# Altium project Goldstrike1_Rev01.PrjPCB (part 4 of 4)

## Sheet GS_01_Core.SchDoc: Title
size A3; Date: Date; CompanyName: Integrated Micro-Electronics Bulgaria; Organization: Design & Development Department; Address1: Drawing Type; Address2: Address 1; Address3: Address 2; Address4: Address 3; DocumentNumber: 730xxx; Revision: 01; SheetNumber: 1; SheetTotal: 1; PageSetup: Record=PageOptions|CenterHorizontal=True|CenterVertical=True|PrintScale=0.70|XCorrection=1.00|YCorrection=1.00|PrintKind=2|BorderSize=5000000|LeftOffset=0|BottomOffset=0|Orientation=2|PaperLength=1000|PaperWidth=1000|Scale=100|PaperSource=7|PrintQuality=-4|MediaType=1|DitherType=10|PaperKind=A4|PrintScaleMode=1; SheetSize: A3; Time: Time; ModifiedDate: Mod. Date
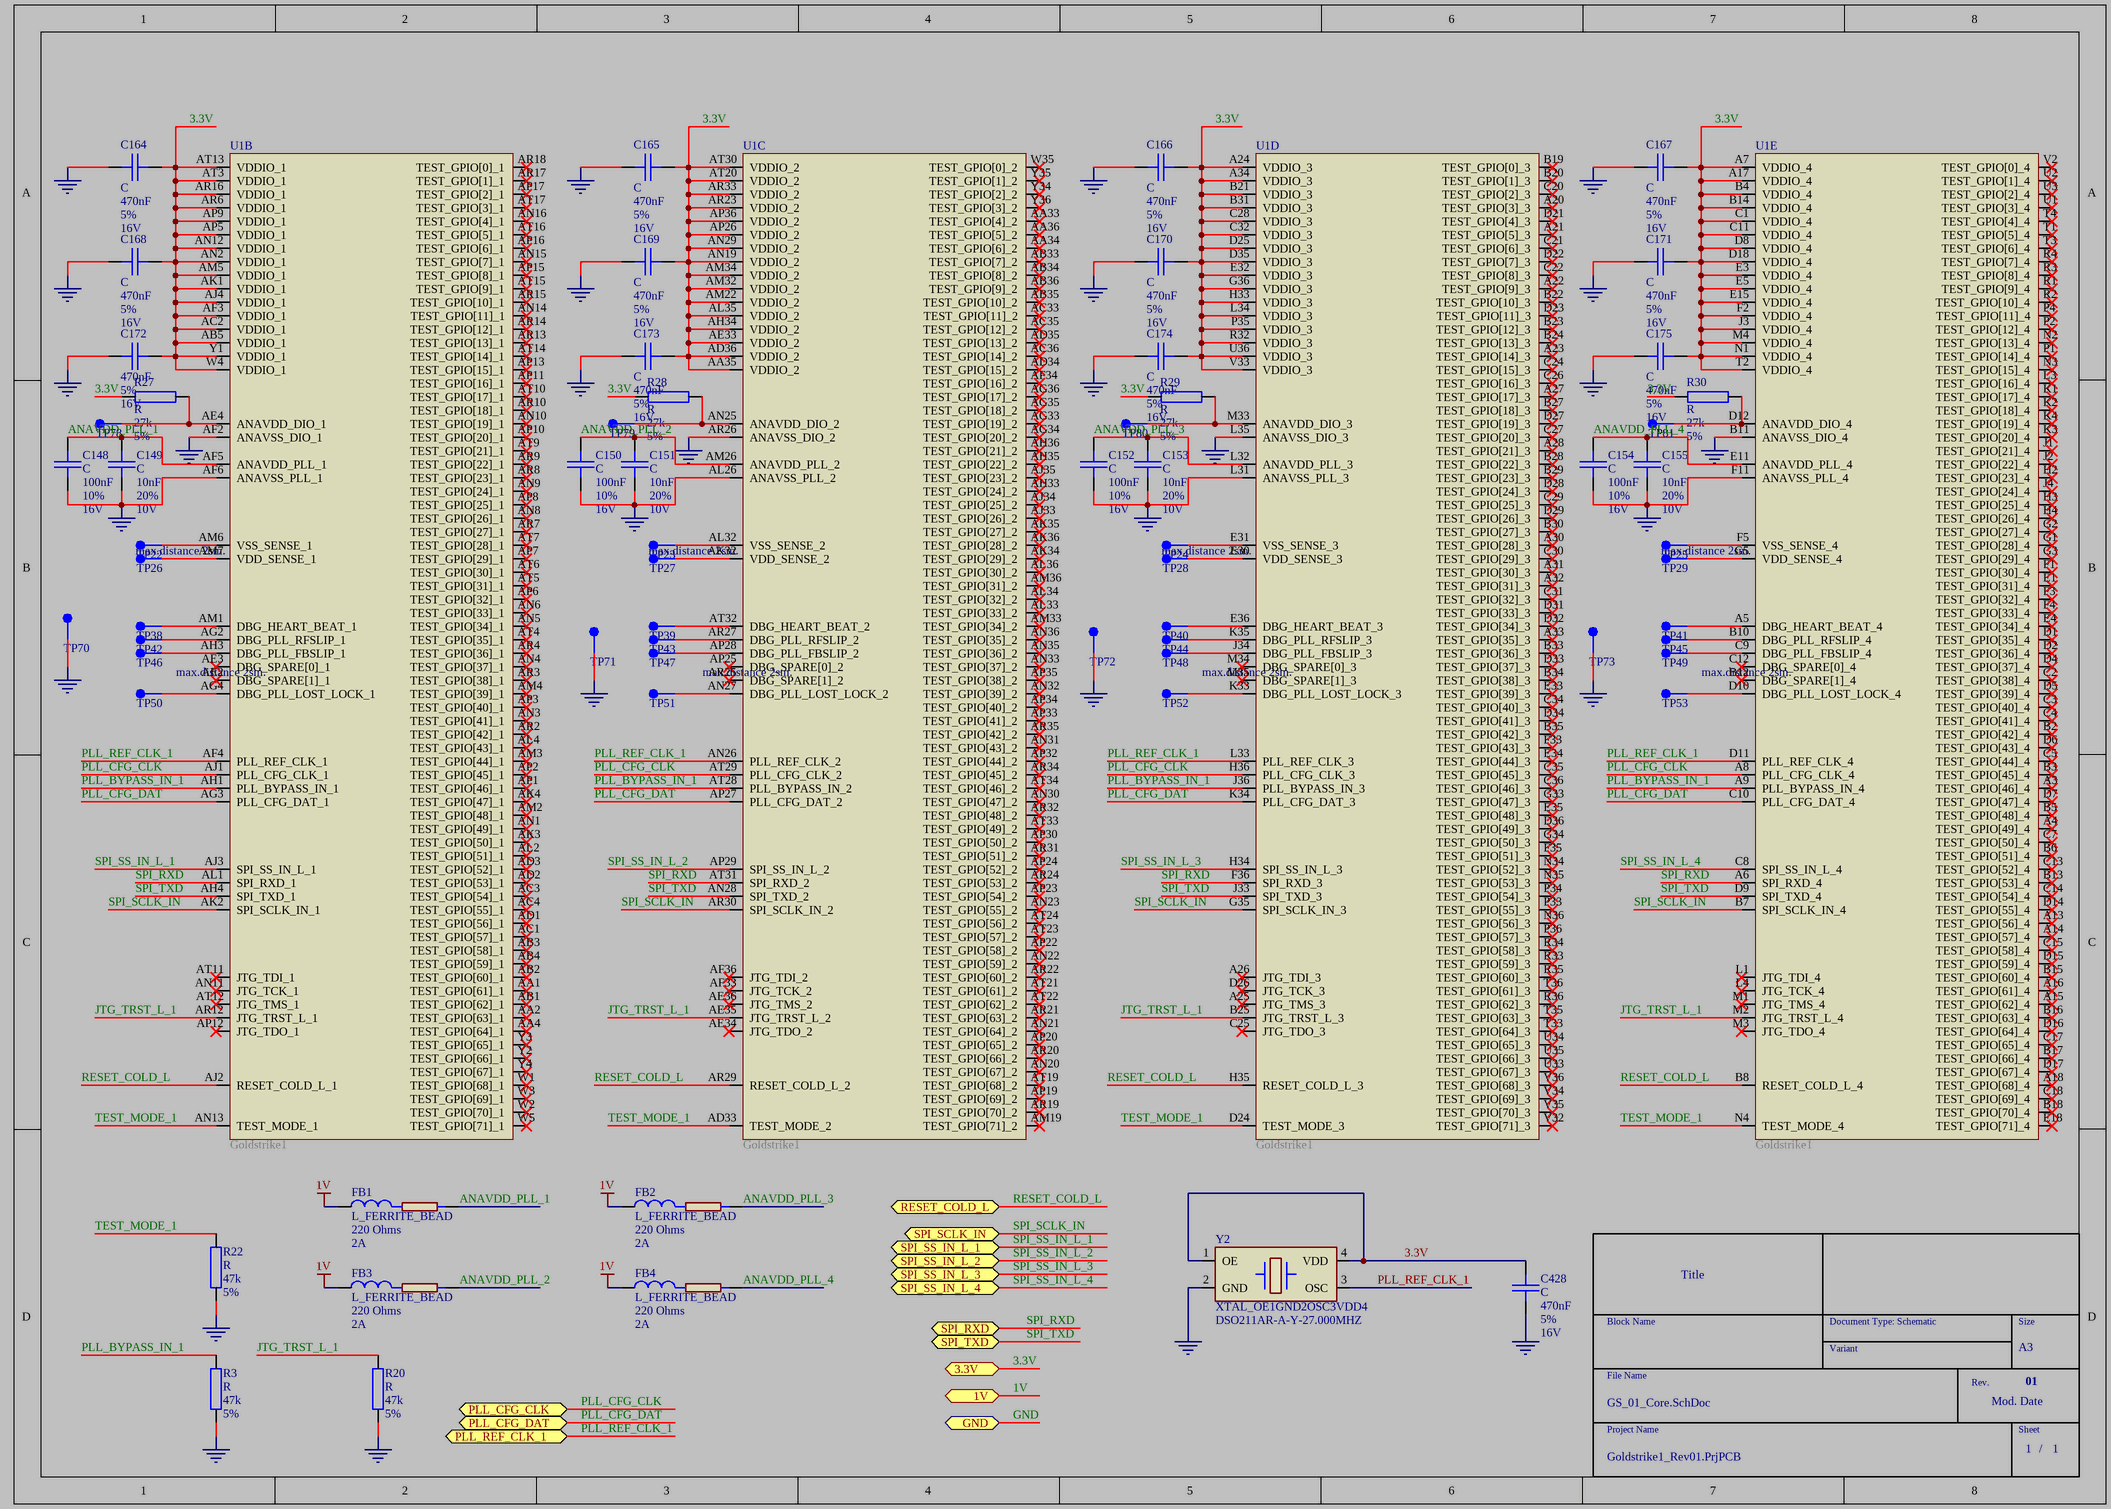
[diagram p9: GS_01_Core.SchDoc]

### Parts
C148  C  DB_VALUE: 100nF  DB_TOLERANCE: 10%  DB_VOLTAGE: 16V  [SMD_0603_CAPC1608X95N]
C149  C  DB_VALUE: 10nF  DB_TOLERANCE: 20%  DB_VOLTAGE: 10V  [SMD_0603_CAPC1608X95N]
C150  C  DB_VALUE: 100nF  DB_TOLERANCE: 10%  DB_VOLTAGE: 16V  [SMD_0603_CAPC1608X95N]
C151  C  DB_VALUE: 10nF  DB_TOLERANCE: 20%  DB_VOLTAGE: 10V  [SMD_0603_CAPC1608X95N]
C152  C  DB_VALUE: 100nF  DB_TOLERANCE: 10%  DB_VOLTAGE: 16V  [SMD_0603_CAPC1608X95N]
C153  C  DB_VALUE: 10nF  DB_TOLERANCE: 20%  DB_VOLTAGE: 10V  [SMD_0603_CAPC1608X95N]
C154  C  DB_VALUE: 100nF  DB_TOLERANCE: 10%  DB_VOLTAGE: 16V  [SMD_0603_CAPC1608X95N]
C155  C  DB_VALUE: 10nF  DB_TOLERANCE: 20%  DB_VOLTAGE: 10V  [SMD_0603_CAPC1608X95N]
C164  C  DB_VALUE: 470nF  DB_TOLERANCE: 5%  DB_VOLTAGE: 16V  [SMD_0603_CAPC1608X95N]
C165  C  DB_VALUE: 470nF  DB_TOLERANCE: 5%  DB_VOLTAGE: 16V  [SMD_0603_CAPC1608X95N]
C166  C  DB_VALUE: 470nF  DB_TOLERANCE: 5%  DB_VOLTAGE: 16V  [SMD_0603_CAPC1608X95N]
C167  C  DB_VALUE: 470nF  DB_TOLERANCE: 5%  DB_VOLTAGE: 16V  [SMD_0603_CAPC1608X95N]
C168  C  DB_VALUE: 470nF  DB_TOLERANCE: 5%  DB_VOLTAGE: 16V  [SMD_0603_CAPC1608X95N]
C169  C  DB_VALUE: 470nF  DB_TOLERANCE: 5%  DB_VOLTAGE: 16V  [SMD_0603_CAPC1608X95N]
C170  C  DB_VALUE: 470nF  DB_TOLERANCE: 5%  DB_VOLTAGE: 16V  [SMD_0603_CAPC1608X95N]
C171  C  DB_VALUE: 470nF  DB_TOLERANCE: 5%  DB_VOLTAGE: 16V  [SMD_0603_CAPC1608X95N]
C172  DB_VALUE: 470nF  DB_TOLERANCE: 5%  DB_VOLTAGE: 16V  [SMD_0603_CAPC1608X95N]  (hidden comment: C)
C173  C  DB_VALUE: 470nF  DB_TOLERANCE: 5%  DB_VOLTAGE: 16V  [SMD_0603_CAPC1608X95N]
C174  C  DB_VALUE: 470nF  DB_TOLERANCE: 5%  DB_VOLTAGE: 16V  [SMD_0603_CAPC1608X95N]
C175  C  DB_VALUE: 470nF  DB_TOLERANCE: 5%  DB_VOLTAGE: 16V  [SMD_0603_CAPC1608X95N]
C428  C  DB_VALUE: 470nF  DB_TOLERANCE: 5%  DB_VOLTAGE: 16V  [SMD_0603_CAPC1608X95N]
FB1  L_FERRITE_BEAD  DB_VALUE: 220 Ohms  DB_CURRENT: 2A  [SMD_0805_INDC2012X105N]
FB2  L_FERRITE_BEAD  DB_VALUE: 220 Ohms  DB_CURRENT: 2A  [SMD_0805_INDC2012X105N]
FB3  L_FERRITE_BEAD  DB_VALUE: 220 Ohms  DB_CURRENT: 2A  [SMD_0805_INDC2012X105N]
FB4  L_FERRITE_BEAD  DB_VALUE: 220 Ohms  DB_CURRENT: 2A  [SMD_0805_INDC2012X105N]
R3  R  DB_VALUE: 47k  DB_TOLERANCE: 5%  [SMD_0603_RESC1608X55N]
R20  R  DB_VALUE: 47k  DB_TOLERANCE: 5%  [SMD_0603_RESC1608X55N]
R22  R  DB_VALUE: 47k  DB_TOLERANCE: 5%  [SMD_0603_RESC1608X55N]
R27  R  DB_VALUE: 27k  DB_TOLERANCE: 5%  [SMD_0603_RESC1608X55N]
R28  R  DB_VALUE: 27k  DB_TOLERANCE: 5%  [SMD_0603_RESC1608X55N]
R29  R  DB_VALUE: 27k  DB_TOLERANCE: 5%  [SMD_0603_RESC1608X55N]
R30  R  DB_VALUE: 27k  DB_TOLERANCE: 5%  [SMD_0603_RESC1608X55N]
TP22  TEST_POINT_1  [SMD_TP_100-254]  (value not drawn)
TP23  TEST_POINT_1  [SMD_TP_100-254]  (value not drawn)
TP24  TEST_POINT_1  [SMD_TP_100-254]  (value not drawn)
TP25  TEST_POINT_1  [SMD_TP_100-254]  (value not drawn)
TP26  TEST_POINT_1  [SMD_TP_100-254]  (value not drawn)
TP27  TEST_POINT_1  [SMD_TP_100-254]  (value not drawn)
TP28  TEST_POINT_1  [SMD_TP_100-254]  (value not drawn)
TP29  TEST_POINT_1  [SMD_TP_100-254]  (value not drawn)
TP38  TEST_POINT_1  [SMD_TP_100-254]  (value not drawn)
TP39  TEST_POINT_1  [SMD_TP_100-254]  (value not drawn)
TP40  TEST_POINT_1  [SMD_TP_100-254]  (value not drawn)
TP41  TEST_POINT_1  [SMD_TP_100-254]  (value not drawn)
TP42  TEST_POINT_1  [SMD_TP_100-254]  (value not drawn)
TP43  TEST_POINT_1  [SMD_TP_100-254]  (value not drawn)
TP44  TEST_POINT_1  [SMD_TP_100-254]  (value not drawn)
TP45  TEST_POINT_1  [SMD_TP_100-254]  (value not drawn)
TP46  TEST_POINT_1  [SMD_TP_100-254]  (value not drawn)
TP47  TEST_POINT_1  [SMD_TP_100-254]  (value not drawn)
TP48  TEST_POINT_1  [SMD_TP_100-254]  (value not drawn)
TP49  TEST_POINT_1  [SMD_TP_100-254]  (value not drawn)
TP50  TEST_POINT_1  [SMD_TP_100-254]  (value not drawn)
TP51  TEST_POINT_1  [SMD_TP_100-254]  (value not drawn)
TP52  TEST_POINT_1  [SMD_TP_100-254]  (value not drawn)
TP53  TEST_POINT_1  [SMD_TP_100-254]  (value not drawn)
TP70  TEST_POINT_1  [SMD_TP_100-254]  (value not drawn)
TP71  TEST_POINT_1  [SMD_TP_100-254]  (value not drawn)
TP72  TEST_POINT_1  [SMD_TP_100-254]  (value not drawn)
TP73  TEST_POINT_1  [SMD_TP_100-254]  (value not drawn)
TP78  TEST_POINT_1  [SMD_TP_100-254]  (value not drawn)
TP79  TEST_POINT_1  [SMD_TP_100-254]  (value not drawn)
TP80  TEST_POINT_1  [SMD_TP_100-254]  (value not drawn)
TP81  TEST_POINT_1  [SMD_TP_100-254]  (value not drawn)
U1  Goldstrike1  [SMD_BGA1296C100P36X36]  (parts B,C,D,E of 5)
Y2  XTAL_OE1GND2OSC3VDD4  DB_VALUE: DSO211AR-A-Y-27.000MHZ  [SMD_OSCCC160X200X80-4N]

### Ports
1V, 3.3V, GND, PLL_CFG_CLK, PLL_CFG_DAT, PLL_REF_CLK_1, RESET_COLD_L, SPI_RXD, SPI_SCLK_IN, SPI_SS_IN_L_1, SPI_SS_IN_L_2, SPI_SS_IN_L_3, SPI_SS_IN_L_4, SPI_TXD

### Nets
1V: FB1.1 FB2.1 FB3.1 FB4.1 ; port 1V
GND: C148.2 C149.2 C150.2 C151.2 C152.2 C153.2 C154.2 C155.2 C164.1 C165.1 C166.1 C167.1 C168.1 C169.1 C170.1 C171.1 C172.1 C173.1 C174.1 C175.1 C428.1 R3.2 R20.2 R22.2 TP70.1 TP71.1 TP72.1 TP73.1 U1.AF2(ANAVSS_DIO_1) U1.AF6(ANAVSS_PLL_1) U1.AL26(ANAVSS_PLL_2) U1.AR26(ANAVSS_DIO_2) U1.B11(ANAVSS_DIO_4) U1.F11(ANAVSS_PLL_4) U1.L31(ANAVSS_PLL_3) U1.L35(ANAVSS_DIO_3) Y2.2(GND) ; port GND
3.3V: C164.2 C165.2 C166.2 C167.2 C168.2 C169.2 C170.2 C171.2 C172.2 C173.2 C174.2 C175.2 C428.2 R27.1 R28.1 R29.1 R30.1 U1.A7(VDDIO_4) U1.A17(VDDIO_4) U1.A24(VDDIO_3) U1.A34(VDDIO_3) U1.AA35(VDDIO_2) U1.AB5(VDDIO_1) U1.AC2(VDDIO_1) U1.AD36(VDDIO_2) U1.AE33(VDDIO_2) U1.AF3(VDDIO_1) U1.AH34(VDDIO_2) U1.AJ4(VDDIO_1) U1.AK1(VDDIO_1) U1.AL35(VDDIO_2) U1.AM5(VDDIO_1) U1.AM22(VDDIO_2) U1.AM32(VDDIO_2) U1.AM34(VDDIO_2) U1.AN2(VDDIO_1) U1.AN12(VDDIO_1) U1.AN19(VDDIO_2) U1.AN29(VDDIO_2) U1.AP5(VDDIO_1) U1.AP9(VDDIO_1) U1.AP26(VDDIO_2) U1.AP36(VDDIO_2) U1.AR6(VDDIO_1) U1.AR16(VDDIO_1) U1.AR23(VDDIO_2) U1.AR33(VDDIO_2) U1.AT3(VDDIO_1) U1.AT13(VDDIO_1) U1.AT20(VDDIO_2) U1.AT30(VDDIO_2) U1.B4(VDDIO_4) U1.B14(VDDIO_4) U1.B21(VDDIO_3) U1.B31(VDDIO_3) U1.C1(VDDIO_4) U1.C11(VDDIO_4) U1.C28(VDDIO_3) U1.C32(VDDIO_3) U1.D8(VDDIO_4) U1.D18(VDDIO_4) U1.D25(VDDIO_3) U1.D35(VDDIO_3) U1.E3(VDDIO_4) U1.E5(VDDIO_4) U1.E15(VDDIO_4) U1.E32(VDDIO_3) U1.F2(VDDIO_4) U1.G36(VDDIO_3) U1.H33(VDDIO_3) U1.J3(VDDIO_4) U1.L34(VDDIO_3) U1.M4(VDDIO_4) U1.N1(VDDIO_4) U1.P35(VDDIO_3) U1.R32(VDDIO_3) U1.T2(VDDIO_4) U1.U36(VDDIO_3) U1.V33(VDDIO_3) U1.W4(VDDIO_1) U1.Y1(VDDIO_1) Y2.1(OE) Y2.4(VDD) ; port 3.3V
ANAVDD_PLL_1: C148.1 C149.1 FB1.2 U1.AF5(ANAVDD_PLL_1)
ANAVDD_PLL_2: C150.1 C151.1 FB3.2 U1.AM26(ANAVDD_PLL_2)
ANAVDD_PLL_3: C152.1 C153.1 FB2.2 U1.L32(ANAVDD_PLL_3)
ANAVDD_PLL_4: C154.1 C155.1 FB4.2 U1.E11(ANAVDD_PLL_4)
JTG_TRST_L_1: R20.1 U1.AE35(JTG_TRST_L_2) U1.AR12(JTG_TRST_L_1) U1.B25(JTG_TRST_L_3) U1.M2(JTG_TRST_L_4)
PLL_BYPASS_IN_1: R3.1 U1.A9(PLL_BYPASS_IN_4) U1.AH1(PLL_BYPASS_IN_1) U1.AT28(PLL_BYPASS_IN_2) U1.J36(PLL_BYPASS_IN_3)
PLL_CFG_CLK: U1.A8(PLL_CFG_CLK_4) U1.AJ1(PLL_CFG_CLK_1) U1.AT29(PLL_CFG_CLK_2) U1.H36(PLL_CFG_CLK_3) ; port PLL_CFG_CLK
PLL_CFG_DAT: U1.AG3(PLL_CFG_DAT_1) U1.AP27(PLL_CFG_DAT_2) U1.C10(PLL_CFG_DAT_4) U1.K34(PLL_CFG_DAT_3) ; port PLL_CFG_DAT
PLL_REF_CLK_1: U1.AF4(PLL_REF_CLK_1) U1.AN26(PLL_REF_CLK_2) U1.D11(PLL_REF_CLK_4) U1.L33(PLL_REF_CLK_3) Y2.3(OSC) ; port PLL_REF_CLK_1
RESET_COLD_L: U1.AJ2(RESET_COLD_L_1) U1.AR29(RESET_COLD_L_2) U1.B8(RESET_COLD_L_4) U1.H35(RESET_COLD_L_3) ; port RESET_COLD_L
SPI_RXD: U1.A6(SPI_RXD_4) U1.AL1(SPI_RXD_1) U1.AT31(SPI_RXD_2) U1.F36(SPI_RXD_3) ; port SPI_RXD
SPI_SCLK_IN: U1.AK2(SPI_SCLK_IN_1) U1.AR30(SPI_SCLK_IN_2) U1.B7(SPI_SCLK_IN_4) U1.G35(SPI_SCLK_IN_3) ; port SPI_SCLK_IN
SPI_SS_IN_L_1: U1.AJ3(SPI_SS_IN_L_1) ; port SPI_SS_IN_L_1
SPI_SS_IN_L_2: U1.AP29(SPI_SS_IN_L_2) ; port SPI_SS_IN_L_2
SPI_SS_IN_L_3: U1.H34(SPI_SS_IN_L_3) ; port SPI_SS_IN_L_3
SPI_SS_IN_L_4: U1.C8(SPI_SS_IN_L_4) ; port SPI_SS_IN_L_4
SPI_TXD: U1.AH4(SPI_TXD_1) U1.AN28(SPI_TXD_2) U1.D9(SPI_TXD_4) U1.J33(SPI_TXD_3) ; port SPI_TXD
TEST_MODE_1: R22.1 U1.AD33(TEST_MODE_2) U1.AN13(TEST_MODE_1) U1.D24(TEST_MODE_3) U1.N4(TEST_MODE_4)
NetR27_2: R27.2 TP78.1 U1.AE4(ANAVDD_DIO_1)
NetR28_2: R28.2 TP79.1 U1.AN25(ANAVDD_DIO_2)
NetR29_2: R29.2 TP80.1 U1.M33(ANAVDD_DIO_3)
NetR30_2: R30.2 TP81.1 U1.D12(ANAVDD_DIO_4)
NetTP22_1: TP22.1 U1.AM6(VSS_SENSE_1)
NetTP23_1: TP23.1 U1.AL32(VSS_SENSE_2)
NetTP24_1: TP24.1 U1.E31(VSS_SENSE_3)
NetTP25_1: TP25.1 U1.F5(VSS_SENSE_4)
NetTP26_1: TP26.1 U1.AM7(VDD_SENSE_1)
NetTP27_1: TP27.1 U1.AK32(VDD_SENSE_2)
NetTP28_1: TP28.1 U1.E30(VDD_SENSE_3)
NetTP29_1: TP29.1 U1.G5(VDD_SENSE_4)
NetTP38_1: TP38.1 U1.AM1(DBG_HEART_BEAT_1)
NetTP39_1: TP39.1 U1.AT32(DBG_HEART_BEAT_2)
NetTP40_1: TP40.1 U1.E36(DBG_HEART_BEAT_3)
NetTP41_1: TP41.1 U1.A5(DBG_HEART_BEAT_4)
NetTP42_1: TP42.1 U1.AG2(DBG_PLL_RFSLIP_1)
NetTP43_1: TP43.1 U1.AR27(DBG_PLL_RFSLIP_2)
NetTP44_1: TP44.1 U1.K35(DBG_PLL_RFSLIP_3)
NetTP45_1: TP45.1 U1.B10(DBG_PLL_RFSLIP_4)
NetTP46_1: TP46.1 U1.AH3(DBG_PLL_FBSLIP_1)
NetTP47_1: TP47.1 U1.AP28(DBG_PLL_FBSLIP_2)
NetTP48_1: TP48.1 U1.J34(DBG_PLL_FBSLIP_3)
NetTP49_1: TP49.1 U1.C9(DBG_PLL_FBSLIP_4)
NetTP50_1: TP50.1 U1.AG4(DBG_PLL_LOST_LOCK_1)
NetTP51_1: TP51.1 U1.AN27(DBG_PLL_LOST_LOCK_2)
NetTP52_1: TP52.1 U1.K33(DBG_PLL_LOST_LOCK_3)
NetTP53_1: TP53.1 U1.D10(DBG_PLL_LOST_LOCK_4)

Not connected (* = marked no-connect by the designer): U1 A3(TEST_GPIO[46]_4)* A4(TEST_GPIO[49]_4)* A13(TEST_GPIO[56]_4)* A14(TEST_GPIO[57]_4)* A15(TEST_GPIO[62]_4)* A16(TEST_GPIO[61]_4)* A18(TEST_GPIO[68]_4)* A20(TEST_GPIO[3]_3)* A21(TEST_GPIO[5]_3)* A22(TEST_GPIO[9]_3)* A23(TEST_GPIO[14]_3)* A25(JTG_TMS_3)* A26(JTG_TDI_3)* A27(TEST_GPIO[17]_3)* A28(TEST_GPIO[21]_3)* A30(TEST_GPIO[28]_3)* A31(TEST_GPIO[30]_3)* A32(TEST_GPIO[31]_3)* A33(TEST_GPIO[35]_3)* AA1(TEST_GPIO[61]_1)* AA2(TEST_GPIO[63]_1)* AA4(TEST_GPIO[64]_1)* AA33(TEST_GPIO[4]_2)* AA34(TEST_GPIO[6]_2)* AA36(TEST_GPIO[5]_2)* AB1(TEST_GPIO[62]_1)* AB2(TEST_GPIO[60]_1)* AB3(TEST_GPIO[58]_1)* AB4(TEST_GPIO[59]_1)* AB33(TEST_GPIO[7]_2)* AB34(TEST_GPIO[8]_2)* AB35(TEST_GPIO[10]_2)* AB36(TEST_GPIO[9]_2)* AC1(TEST_GPIO[57]_1)* AC3(TEST_GPIO[54]_1)* AC4(TEST_GPIO[55]_1)* AC33(TEST_GPIO[11]_2)* AC35(TEST_GPIO[12]_2)* AC36(TEST_GPIO[14]_2)* AD1(TEST_GPIO[56]_1)* AD2(TEST_GPIO[53]_1)* AD3(TEST_GPIO[52]_1)* AD34(TEST_GPIO[15]_2)* AD35(TEST_GPIO[13]_2)* AE2(DBG_SPARE[1]_1)* AE3(DBG_SPARE[0]_1)* AE34(JTG_TDO_2)* AE36(JTG_TMS_2)* AF33(JTG_TCK_2)* AF34(TEST_GPIO[16]_2)* AF36(JTG_TDI_2)* AG33(TEST_GPIO[19]_2)* AG34(TEST_GPIO[20]_2)* AG35(TEST_GPIO[18]_2)* AG36(TEST_GPIO[17]_2)* AH33(TEST_GPIO[24]_2)* AH35(TEST_GPIO[22]_2)* AH36(TEST_GPIO[21]_2)* AJ33(TEST_GPIO[26]_2)* AJ34(TEST_GPIO[25]_2)* AJ35(TEST_GPIO[23]_2)* AK3(TEST_GPIO[50]_1)* AK4(TEST_GPIO[47]_1)* AK34(TEST_GPIO[29]_2)* AK35(TEST_GPIO[27]_2)* AK36(TEST_GPIO[28]_2)* AL2(TEST_GPIO[51]_1)* AL4(TEST_GPIO[43]_1)* AL33(TEST_GPIO[33]_2)* AL34(TEST_GPIO[32]_2)* AL36(TEST_GPIO[30]_2)* AM2(TEST_GPIO[48]_1)* AM3(TEST_GPIO[44]_1)* AM4(TEST_GPIO[39]_1)* AM19(TEST_GPIO[71]_2)* AM33(TEST_GPIO[34]_2)* AM36(TEST_GPIO[31]_2)* AN1(TEST_GPIO[49]_1)* AN3(TEST_GPIO[41]_1)* AN4(TEST_GPIO[37]_1)* AN5(TEST_GPIO[34]_1)* AN6(TEST_GPIO[33]_1)* AN8(TEST_GPIO[26]_1)* AN9(TEST_GPIO[24]_1)* AN10(TEST_GPIO[19]_1)* AN11(JTG_TCK_1)* AN14(TEST_GPIO[11]_1)* AN15(TEST_GPIO[7]_1)* AN16(TEST_GPIO[4]_1)* AN20(TEST_GPIO[67]_2)* AN21(TEST_GPIO[64]_2)* AN22(TEST_GPIO[59]_2)* AN23(TEST_GPIO[55]_2)* AN30(TEST_GPIO[47]_2)* AN31(TEST_GPIO[43]_2)* AN32(TEST_GPIO[39]_2)* AN33(TEST_GPIO[37]_2)* AN35(TEST_GPIO[36]_2)* AN36(TEST_GPIO[35]_2)* AP1(TEST_GPIO[46]_1)* AP2(TEST_GPIO[45]_1)* AP3(TEST_GPIO[40]_1)* AP6(TEST_GPIO[32]_1)* AP7(TEST_GPIO[29]_1)* AP8(TEST_GPIO[25]_1)* AP10(TEST_GPIO[20]_1)* AP11(TEST_GPIO[16]_1)* AP12(JTG_TDO_1)* AP13(TEST_GPIO[15]_1)* AP15(TEST_GPIO[8]_1)* AP16(TEST_GPIO[6]_1)* AP17(TEST_GPIO[2]_1)* AP19(TEST_GPIO[69]_2)* AP20(TEST_GPIO[65]_2)* AP22(TEST_GPIO[58]_2)* AP23(TEST_GPIO[54]_2)* AP24(TEST_GPIO[52]_2)* AP25(DBG_SPARE[0]_2)* AP30(TEST_GPIO[50]_2)* AP32(TEST_GPIO[44]_2)* AP33(TEST_GPIO[41]_2)* AP34(TEST_GPIO[40]_2)* AP35(TEST_GPIO[38]_2)* AR2(TEST_GPIO[42]_1)* AR3(TEST_GPIO[38]_1)* AR4(TEST_GPIO[36]_1)* AR7(TEST_GPIO[27]_1)* AR8(TEST_GPIO[23]_1)* AR9(TEST_GPIO[22]_1)* AR10(TEST_GPIO[18]_1)* AR13(TEST_GPIO[13]_1)* AR14(TEST_GPIO[12]_1)* AR15(TEST_GPIO[10]_1)* AR17(TEST_GPIO[1]_1)* AR18(TEST_GPIO[0]_1)* AR19(TEST_GPIO[70]_2)* AR20(TEST_GPIO[66]_2)* AR21(TEST_GPIO[63]_2)* AR22(TEST_GPIO[60]_2)* AR24(TEST_GPIO[53]_2)* AR25(DBG_SPARE[1]_2)* AR31(TEST_GPIO[51]_2)* AR32(TEST_GPIO[48]_2)* AR34(TEST_GPIO[45]_2)* AR35(TEST_GPIO[42]_2)* AT4(TEST_GPIO[35]_1)* AT5(TEST_GPIO[31]_1)* AT6(TEST_GPIO[30]_1)* AT7(TEST_GPIO[28]_1)* AT9(TEST_GPIO[21]_1)* AT10(TEST_GPIO[17]_1)* AT11(JTG_TDI_1)* AT12(JTG_TMS_1)* AT14(TEST_GPIO[14]_1)* AT15(TEST_GPIO[9]_1)* AT16(TEST_GPIO[5]_1)* AT17(TEST_GPIO[3]_1)* AT19(TEST_GPIO[68]_2)* AT21(TEST_GPIO[61]_2)* AT22(TEST_GPIO[62]_2)* AT23(TEST_GPIO[57]_2)* AT24(TEST_GPIO[56]_2)* AT33(TEST_GPIO[49]_2)* AT34(TEST_GPIO[46]_2)* B2(TEST_GPIO[42]_4)* B3(TEST_GPIO[45]_4)* B5(TEST_GPIO[48]_4)* B6(TEST_GPIO[51]_4)* B12(DBG_SPARE[1]_4)* B13(TEST_GPIO[53]_4)* B15(TEST_GPIO[60]_4)* B16(TEST_GPIO[63]_4)* B17(TEST_GPIO[66]_4)* B18(TEST_GPIO[70]_4)* B19(TEST_GPIO[0]_3)* B20(TEST_GPIO[1]_3)* B22(TEST_GPIO[10]_3)* B23(TEST_GPIO[12]_3)* B24(TEST_GPIO[13]_3)* B27(TEST_GPIO[18]_3)* B28(TEST_GPIO[22]_3)* B29(TEST_GPIO[23]_3)* B30(TEST_GPIO[27]_3)* B33(TEST_GPIO[36]_3)* B34(TEST_GPIO[38]_3)* B35(TEST_GPIO[42]_3)* C2(TEST_GPIO[38]_4)* C3(TEST_GPIO[40]_4)* C4(TEST_GPIO[41]_4)* C5(TEST_GPIO[44]_4)* C7(TEST_GPIO[50]_4)* C12(DBG_SPARE[0]_4)* C13(TEST_GPIO[52]_4)* C14(TEST_GPIO[54]_4)* C15(TEST_GPIO[58]_4)* C17(TEST_GPIO[65]_4)* C18(TEST_GPIO[69]_4)* C20(TEST_GPIO[2]_3)* C21(TEST_GPIO[6]_3)* C22(TEST_GPIO[8]_3)* C24(TEST_GPIO[15]_3)* C25(JTG_TDO_3)* C26(TEST_GPIO[16]_3)* C27(TEST_GPIO[20]_3)* C29(TEST_GPIO[25]_3)* C30(TEST_GPIO[29]_3)* C31(TEST_GPIO[32]_3)* C34(TEST_GPIO[40]_3)* C35(TEST_GPIO[45]_3)* C36(TEST_GPIO[46]_3)* D1(TEST_GPIO[35]_4)* D2(TEST_GPIO[36]_4)* D4(TEST_GPIO[37]_4)* D5(TEST_GPIO[39]_4)* D6(TEST_GPIO[43]_4)* D7(TEST_GPIO[47]_4)* D14(TEST_GPIO[55]_4)* D15(TEST_GPIO[59]_4)* D16(TEST_GPIO[64]_4)* D17(TEST_GPIO[67]_4)* D21(TEST_GPIO[4]_3)* D22(TEST_GPIO[7]_3)* D23(TEST_GPIO[11]_3)* D26(JTG_TCK_3)* D27(TEST_GPIO[19]_3)* D28(TEST_GPIO[24]_3)* D29(TEST_GPIO[26]_3)* D31(TEST_GPIO[33]_3)* D32(TEST_GPIO[34]_3)* D33(TEST_GPIO[37]_3)* D34(TEST_GPIO[41]_3)* D36(TEST_GPIO[49]_3)* E1(TEST_GPIO[31]_4)* E4(TEST_GPIO[34]_4)* E18(TEST_GPIO[71]_4)* E33(TEST_GPIO[39]_3)* E34(TEST_GPIO[44]_3)* E35(TEST_GPIO[48]_3)* F1(TEST_GPIO[30]_4)* F3(TEST_GPIO[32]_4)* F4(TEST_GPIO[33]_4)* F33(TEST_GPIO[43]_3)* F35(TEST_GPIO[51]_3)* G1(TEST_GPIO[28]_4)* G2(TEST_GPIO[27]_4)* G3(TEST_GPIO[29]_4)* G33(TEST_GPIO[47]_3)* G34(TEST_GPIO[50]_3)* H2(TEST_GPIO[23]_4)* H3(TEST_GPIO[25]_4)* H4(TEST_GPIO[26]_4)* J1(TEST_GPIO[21]_4)* J2(TEST_GPIO[22]_4)* J4(TEST_GPIO[24]_4)* K1(TEST_GPIO[17]_4)* K2(TEST_GPIO[18]_4)* K3(TEST_GPIO[20]_4)* K4(TEST_GPIO[19]_4)* L1(JTG_TDI_4)* L3(TEST_GPIO[16]_4)* L4(JTG_TCK_4)* M1(JTG_TMS_4)* M3(JTG_TDO_4)* M34(DBG_SPARE[0]_3)* M35(DBG_SPARE[1]_3)* N2(TEST_GPIO[13]_4)* N3(TEST_GPIO[15]_4)* N34(TEST_GPIO[52]_3)* N35(TEST_GPIO[53]_3)* N36(TEST_GPIO[56]_3)* P1(TEST_GPIO[14]_4)* P2(TEST_GPIO[12]_4)* P4(TEST_GPIO[11]_4)* P33(TEST_GPIO[55]_3)* P34(TEST_GPIO[54]_3)* P36(TEST_GPIO[57]_3)* R1(TEST_GPIO[9]_4)* R2(TEST_GPIO[10]_4)* R3(TEST_GPIO[8]_4)* R4(TEST_GPIO[7]_4)* R33(TEST_GPIO[59]_3)* R34(TEST_GPIO[58]_3)* R35(TEST_GPIO[60]_3)* R36(TEST_GPIO[62]_3)* T1(TEST_GPIO[5]_4)* T3(TEST_GPIO[6]_4)* T4(TEST_GPIO[4]_4)* T33(TEST_GPIO[64]_3)* T35(TEST_GPIO[63]_3)* T36(TEST_GPIO[61]_3)* U1(TEST_GPIO[3]_4)* U2(TEST_GPIO[1]_4)* U3(TEST_GPIO[2]_4)* U33(TEST_GPIO[67]_3)* U34(TEST_GPIO[65]_3)* U35(TEST_GPIO[66]_3)* V2(TEST_GPIO[0]_4)* V32(TEST_GPIO[71]_3)* V34(TEST_GPIO[69]_3)* V35(TEST_GPIO[70]_3)* V36(TEST_GPIO[68]_3)* W1(TEST_GPIO[68]_1)* W2(TEST_GPIO[70]_1)* W3(TEST_GPIO[69]_1)* W5(TEST_GPIO[71]_1)* W35(TEST_GPIO[0]_2)* Y2(TEST_GPIO[66]_1)* Y3(TEST_GPIO[65]_1)* Y4(TEST_GPIO[67]_1)* Y34(TEST_GPIO[2]_2)* Y35(TEST_GPIO[1]_2)* Y36(TEST_GPIO[3]_2)*

### Notes on the sheet
- max.distance 2sm.
- Block Name
- Document Type: Schematic
- Size
- File Name
- Variant
- Rev.
- Project Name
- Sheet
- /

### Library data of the parts
C148 C150 C152 C154 = CAP000047357: DB_MANUFACTURER_PART: YAGEO      223878615649; DB_PART_TYPE: Ceramic_SMD\Standard_X7R; NOTE: <NOTE>; DB_APPROVED_BY: VSN; DB_APPROVED_ON: 16.5.2014 г. 14:44:10; DB_DESCRIPTION: C X7R 100nF 10% 16V 0603; DB_PACKAGE: 0603; DB_STATUS: NEW; DB_T_RANGE: -55 to 125; DB_PART_NUMBER: CAP000047357; DB_DATASHEET: http://john.epiqdesign.com/projects/CIS_Datasheets/22_X7R_YAGEO_capacitor_series_9.pdf?rev=1422&sc=0; DB_PCB_DEVICE: SMD_0603_CAPC1608X95N
C149 C151 C153 C155 = CAP000038821: DB_MANUFACTURER_PART: KEMET    C0603C103M8GAC; DB_PART_TYPE: Ceramic_SMD\Standard_C0G; NOTE: <NOTE>; DB_APPROVED_ON: 09.10.2010 г.; DB_DESCRIPTION: C C0G 10nF 20% 10V 0603; DB_PACKAGE: 0603; DB_STATUS: NEW; DB_T_RANGE: -55 to 125; DB_PART_NUMBER: CAP000038821; DB_DATASHEET: http://john.epiqdesign.com/projects/CIS_Datasheets/F3102_CE_Kemet.pdf?rev=92&sc=0; DB_PCB_DEVICE: SMD_0603_CAPC1608X95N
C164-C175 C428 = CAP000028169: DB_PART_TYPE: Ceramic_SMD\Standard_X7R; DB_MANUFACTURER_PART: KEMET    C0603C474J4RAC; NOTE: <NOTE>; DB_T_RANGE: -55 to 125; DB_PACKAGE: 0603; DB_DESCRIPTION: C X7R 470nF 5% 16V 0603; DB_APPROVED_ON: 09.10.2010 г.; DB_STATUS: NEW; DB_PART_NUMBER: CAP000028169; DB_PCB_DEVICE: SMD_0603_CAPC1608X95N; DB_DATASHEET: http://john.epiqdesign.com/projects/CIS_Datasheets/F3102_CE_Kemet.pdf?rev=92&sc=0
FB1-FB4 = IND000000029: DB_PART_TYPE: Inductor; DB_MANUFACTURER_PART: MURATA       BLM21PG221SN1D; NOTE: <NOTE>; DB_TOLERANCE: 25%; DB_T_RANGE: -55 to 125; DB_PACKAGE: 0805; DB_DESCRIPTION: INDUC 220 Ohms 25% 0805; DB_APPROVED_BY: VSN; DB_APPROVED_ON: 30.6.2011 г. 07:59:29; DB_STATUS: NEW; DB_PART_NUMBER: IND000000029; DB_PCB_DEVICE: SMD_0805_INDC2012X105N; DB_DATASHEET: http://john.epiqdesign.com/projects/CIS_Datasheets/BLM21P_MURATA.pdf?rev=325&sc=0
R3 R20 R22 = RES000006462: DB_PART_TYPE: SMD; DB_MANUFACTURER_PART: YAGEO    RC0603JR-0747K; NOTE: <NOTE>; DB_T_RANGE: -55 to 155; DB_POWER: 1/10W; DB_PACKAGE: 0603; DB_DESCRIPTION: R SMD 47K 5% 1/10W 0603; DB_PRICE: 0.000364; DB_MOQ: 5000; DB_APPROVED_ON: 09.10.2010 г.; DB_STATUS: NEW; R_BDS: R; DB_PART_NUMBER: RES000006462; DB_PCB_DEVICE: SMD_0603_RESC1608X55N; DB_PRICE_DATE: 2010-12-23; DB_DATASHEET: http://john.epiqdesign.com/projects/CIS_Datasheets/PYu-RC0603_51_RoHS_L_4_YAGEO.pdf?rev=138&sc=0
R27-R30 = RES000006456: DB_PART_TYPE: SMD; DB_MANUFACTURER_PART: YAGEO    RC0603JR-0727K; NOTE: <NOTE>; DB_T_RANGE: -55 to 155; DB_POWER: 1/10W; DB_PACKAGE: 0603; DB_DESCRIPTION: R SMD 27K 5% 1/10W 0603; DB_PRICE: 0.000364; DB_MOQ: 5000; DB_APPROVED_ON: 09.10.2010 г.; DB_STATUS: NEW; R_BDS: R; DB_PART_NUMBER: RES000006456; DB_PCB_DEVICE: SMD_0603_RESC1608X55N; DB_PRICE_DATE: 2010-12-23; DB_DATASHEET: http://john.epiqdesign.com/projects/CIS_Datasheets/PYu-RC0603_51_RoHS_L_4_YAGEO.pdf?rev=138&sc=0
TP22-TP29 TP38-TP53 TP70-TP73 TP78-TP81 = TPO000000001: DB_PART_TYPE: Test Point; DB_VALUE: 100_254; DB_DESCRIPTION: Test Point 100_254; DB_APPROVED_ON: 10.9.2010 г.; DB_STATUS: NEW; DB_PART_NUMBER: TPO000000001; DB_DIAMETER: 100_254; DB_PCB_DEVICE: SMD_TP_100-254
Y2 = OSC000000015: DB_PART_TYPE: Oscillator; DB_MANUFACTURER_PART: KDS DAISHINKU      DSO211AR-A-Y-27.000MHZ; NOTE: <NOTE>; DB_ACCURACY: 100ppm; DB_T_RANGE: -40 to 125; DB_VOLTAGE: 3.3V; DB_FREQUENCY: 27MHz; DB_PACKAGE: SMT; DB_DESCRIPTION: IC DSO211AR 27MHZ; DB_CERTIFIED: AUT; DB_APPROVED_BY: VSN; DB_APPROVED_ON: 09.1.2013 г. 13:52:02; DB_STATUS: NEW; DB_PART_NUMBER: OSC000000015; DB_PCB_DEVICE: SMD_OSCCC160X200X80-4N; DB_DATASHEET: http://john.epiqdesign.com/projects/CIS_Datasheets/DSO211AR.pdf?rev=1025&sc=0
U1 = Goldstrike1: DB_PCB_DEVICE: SMD_BGA1296C100P36X36

## Nets that join several sheets
1V: GS_01_Pow (460 pins), GS_02_Core (FB6.1 FB7.1 FB8.1 FB9.1), GS_02_Pow (460 pins), MCU (R6.2), SMPS (112 pins), GS_01_Core (FB1.1 FB2.1 FB3.1 FB4.1)
GND: GS_01_Pow (536 pins), GS_02_Core (37 pins), GS_02_Pow (536 pins), MCU (80 pins), SMPS (320 pins), GS_01_Core (37 pins)
3.3V: GS_02_Core (83 pins), MCU (20 pins), SMPS (32 pins), GS_01_Core (83 pins)
5.0V: MCU (8 pins), SMPS (48 pins)
12V: MCU (32 pins), SMPS (128 pins)
PLL_CFG_CLK: GS_02_Core (U2.A8 U2.AJ1 U2.AT29 U2.H36), MCU (R26.1 U3.59), GS_01_Core (U1.A8 U1.AJ1 U1.AT29 U1.H36)
PLL_CFG_DAT: GS_02_Core (U2.AG3 U2.AP27 U2.C10 U2.K34), MCU (U3.58), GS_01_Core (U1.AG3 U1.AP27 U1.C10 U1.K34)
PLL_REF_CLK_1: MCU (R7.2 R8.2), GS_01_Core (5 pins)
PLL_REF_CLK_2: GS_02_Core (5 pins), MCU (R8.1 R18.2)
PWM1H: MCU (U3.61), SMPS (U12.5 U14.5)
PWM1L: MCU (U3.60), SMPS (U11.5 U13.5)
PWM2H: MCU (U3.63), SMPS (U16.5 U18.5)
PWM2L: MCU (U3.62), SMPS (U15.5 U17.5)
PWM3H: MCU (U3.1), SMPS (U20.5 U22.5)
PWM3L: MCU (U3.64), SMPS (U19.5 U21.5)
PWM4H: MCU (U3.3), SMPS (U24.5 U26.5)
PWM4L: MCU (U3.2), SMPS (U23.5 U25.5)
RESET_COLD_L: GS_02_Core (U2.AJ2 U2.AR29 U2.B8 U2.H35), MCU (R21.2 U3.8), GS_01_Core (U1.AJ2 U1.AR29 U1.B8 U1.H35)
SPI_RXD: GS_02_Core (U2.A6 U2.AL1 U2.AT31 U2.F36), MCU (U3.6), GS_01_Core (U1.A6 U1.AL1 U1.AT31 U1.F36)
SPI_SCLK_IN: GS_02_Core (U2.AK2 U2.AR30 U2.B7 U2.G35), MCU (U3.4), GS_01_Core (U1.AK2 U1.AR30 U1.B7 U1.G35)
SPI_SS_IN_L_1: MCU (U3.32), GS_01_Core (U1.AJ3)
SPI_SS_IN_L_2: MCU (U3.31), GS_01_Core (U1.AP29)
SPI_SS_IN_L_3: MCU (U3.30), GS_01_Core (U1.H34)
SPI_SS_IN_L_4: MCU (U3.29), GS_01_Core (U1.C8)
SPI_SS_IN_L_5: GS_02_Core (U2.AJ3), MCU (U3.28)
SPI_SS_IN_L_6: GS_02_Core (U2.AP29), MCU (U3.27)
SPI_SS_IN_L_7: GS_02_Core (U2.H34), MCU (U3.24)
SPI_SS_IN_L_8: GS_02_Core (U2.C8), MCU (U3.23)
SPI_TXD: GS_02_Core (U2.AH4 U2.AN28 U2.D9 U2.J33), MCU (U3.5), GS_01_Core (U1.AH4 U1.AN28 U1.D9 U1.J33)